# Altium schematic sheet Accelerometer.SchDoc: Accelerometer
size 203 x 127 mm; DrawnBy: Kace Chandler; DocumentNumber: 6; SheetNumber: 6; SheetTotal: 23
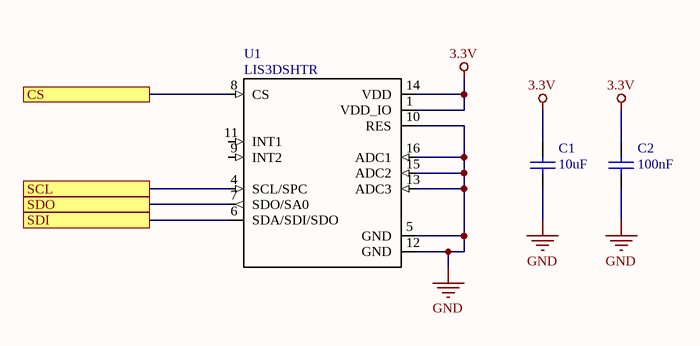
[diagram p0: Accelerometer.SchDoc]

## Parts
C1  value 10uF  [0603 to 1210 SMD]  (hidden comment: Cap)
C2  value 100nF  [0603 to 0805 SMD]  (hidden comment: Cap)
U1  LIS3DSHTR  [L3GD20HTR]

## Ports
CS, SCL, SDI, SDO

## Nets
3.3V: C1.2 C2.2 U1.1(VDD_IO) U1.14(VDD)
GND: C1.1 C2.1 U1.5(GND) U1.10(RES) U1.12(GND) U1.13(ADC3) U1.15(ADC2) U1.16(ADC1)
CS: U1.8(CS) ; port CS
SCL: U1.4(SCL/SPC) ; port SCL
SDI: U1.6(SDA/SDI/SDO) ; port SDI
SDO: U1.7(SDO/SA0) ; port SDO

Not connected (* = marked no-connect by the designer): U1 9(INT2) 11(INT1)

## Library data of the parts
U1 = LIS3DSHTR: Accelerometer / MEMS digital output motion sensor: ultra low-power high performance 3-axes nano accelerometer; MF: STMicroelectronics; Price: None; MP: LIS3DSHTR; Availability: Unavailable; SnapEDA_Link: https://www.snapeda.com/parts/LIS3DSHTR/STMicroelectronics/view-part/?ref=snap; Package: LGA-16 STMicroelectronics; Value: *; Supplier 1: Digi-Key; Supplier Part Number 1: 497-13244-1-ND